# EAGLE schematic PCB_TEST (EAGLE 9.6.2)
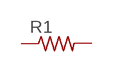
[diagram p0: schematic, sheet 1]

## Parts
R1  R-US_0204/7  [0204/7]
Unconnected: R1.1 R1.2

## Library data of the parts
R1 = rcl:R-US_: RESISTOR, American symbol; SPICEPREFIX: R